# EAGLE design Power (EAGLE 7.1.0)
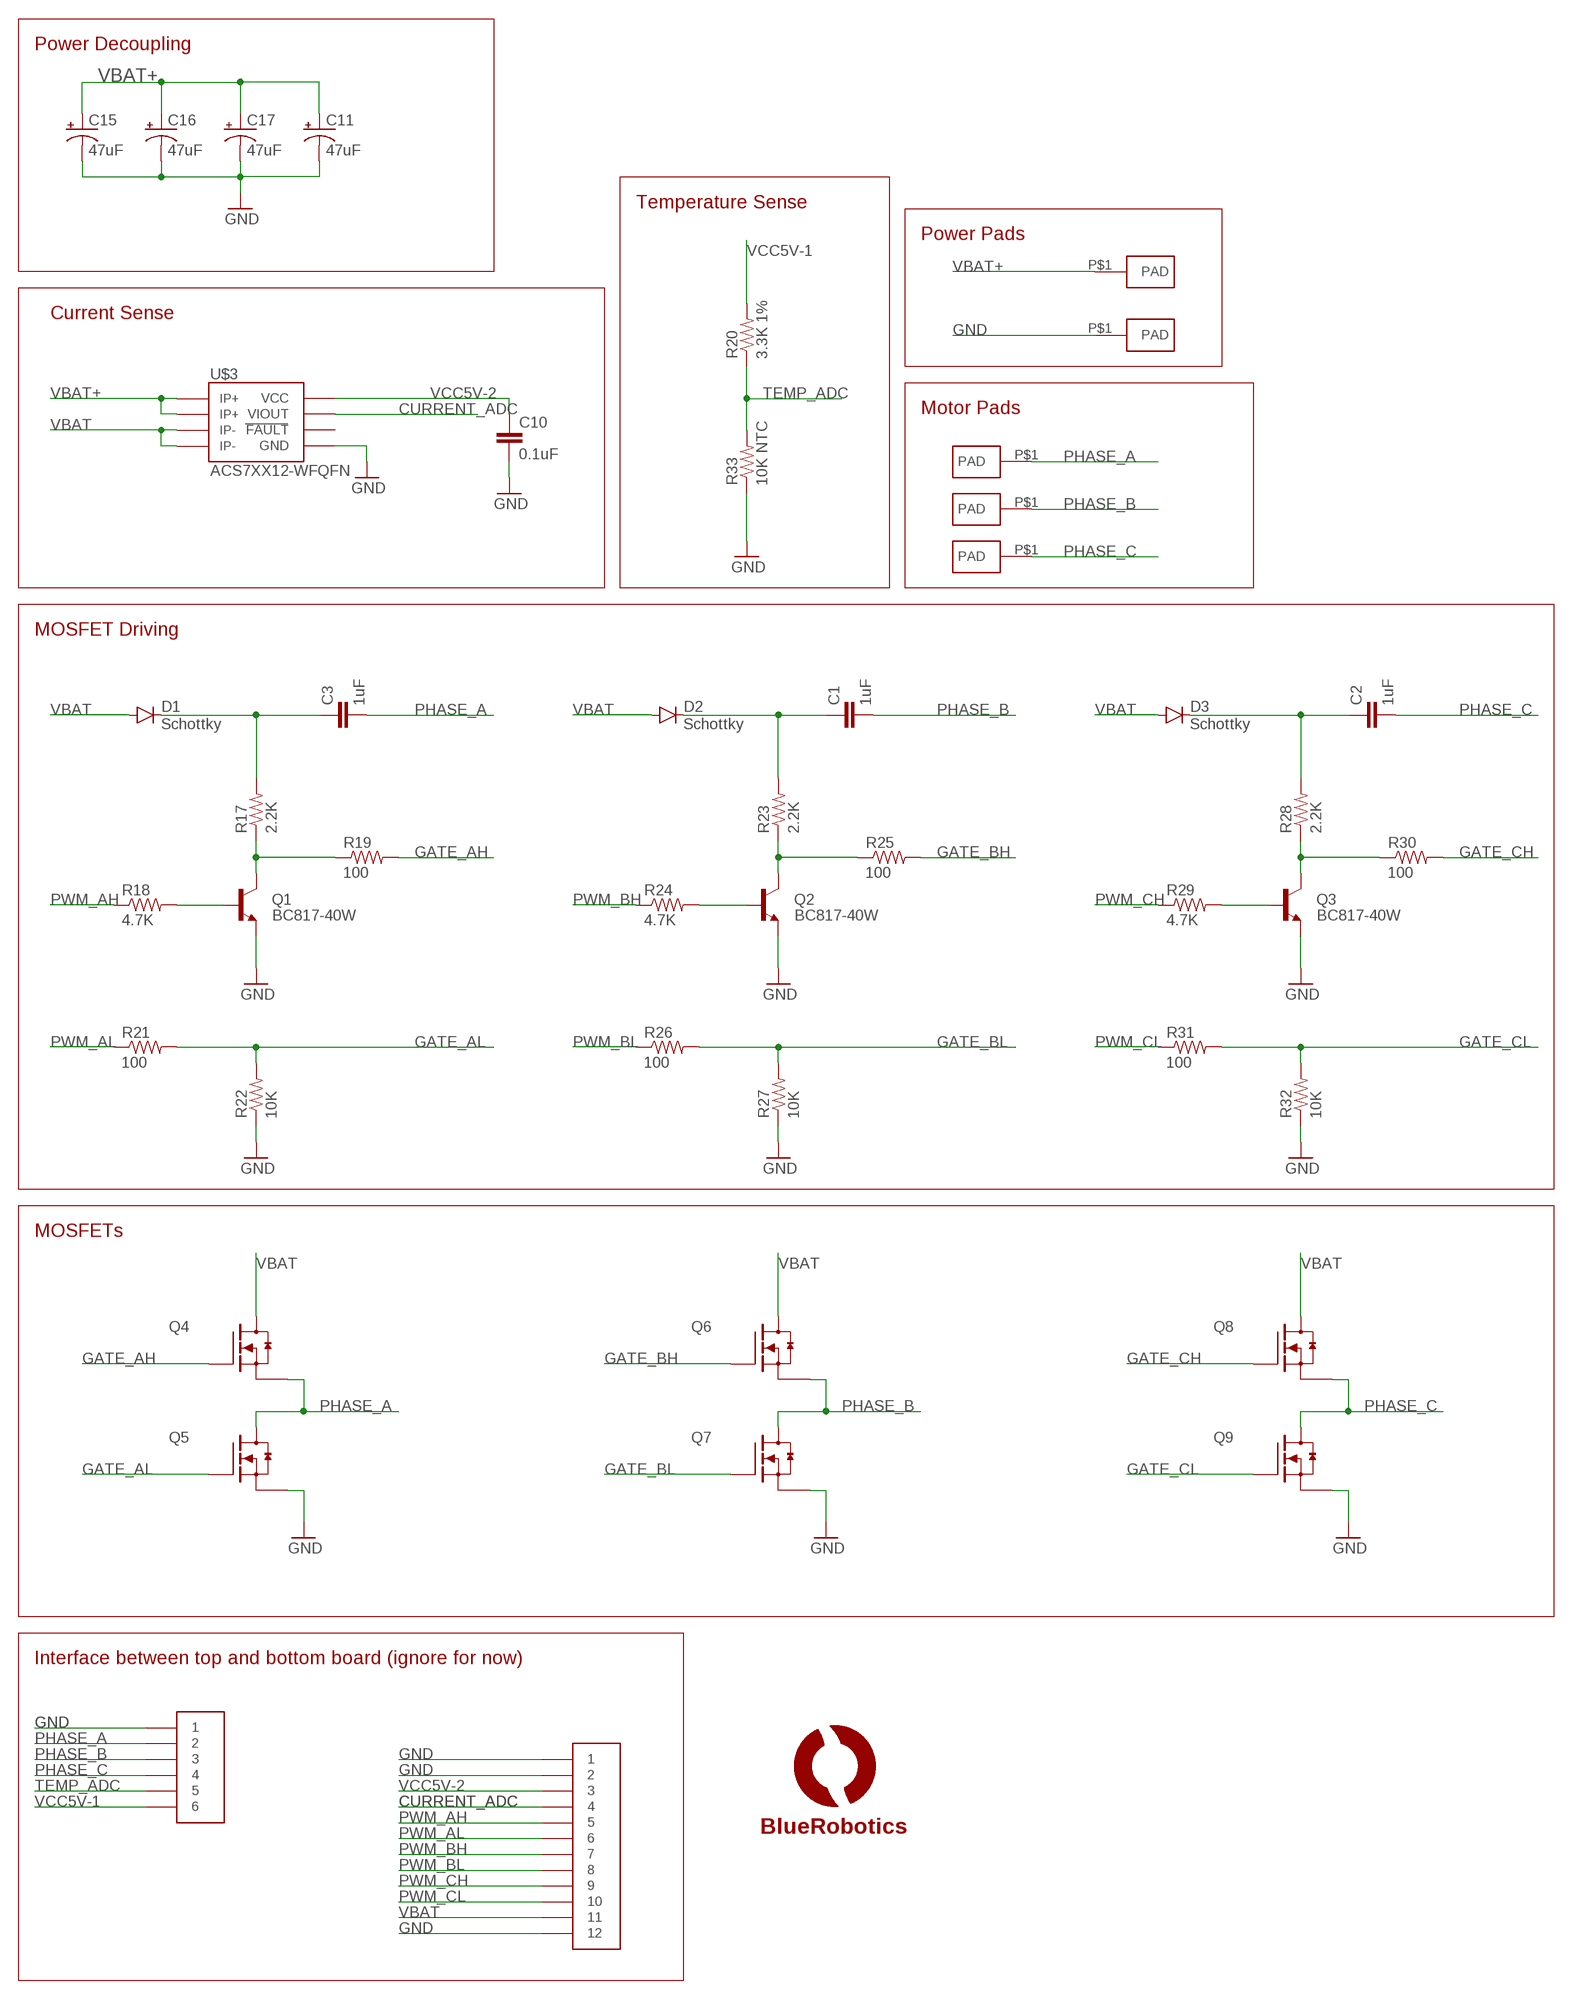
[diagram p0: schematic, sheet 1]

## Parts
C1  1uF  CAP0805  [0805]
C2  1uF  CAP0805  [0805]
C3  1uF  CAP0805  [0805]
C10  0.1uF  CAP0603-CAP  [0603-CAP]
C11  47uF  CAP_POL7343  [EIA7343]
C15  47uF  CAP_POL7343  [EIA7343]
C16  47uF  CAP_POL7343  [EIA7343]
C17  47uF  CAP_POL7343  [EIA7343]
D1  Schottky  DIODESOD  [SOD-323]
D2  Schottky  DIODESOD  [SOD-323]
D3  Schottky  DIODESOD  [SOD-323]
Q1  BC817-40W  TRANSISTOR_NPNSOT23  [SOT23]
Q2  BC817-40W  TRANSISTOR_NPNSOT23  [SOT23]
Q3  BC817-40W  TRANSISTOR_NPNSOT23  [SOT23]
Q4  SI7370  [POWERPAK-SO-08]
Q5  SI7370  [POWERPAK-SO-08]
Q6  SI7370  [POWERPAK-SO-08]
Q7  SI7370  [POWERPAK-SO-08]
Q8  SI7370  [POWERPAK-SO-08]
Q9  SI7370  [POWERPAK-SO-08]
R17  2.2K  33KOHM1/10W1%(0603)  [0603-RES]
R18  4.7K  33KOHM1/10W1%(0603)  [0603-RES]
R19  100  33KOHM1/10W1%(0603)  [0603-RES]
R20  3.3K 1%  33KOHM1/10W1%(0603)  [0603-RES]
R21  100  33KOHM1/10W1%(0603)  [0603-RES]
R22  10K  33KOHM1/10W1%(0603)  [0603-RES]
R23  2.2K  33KOHM1/10W1%(0603)  [0603-RES]
R24  4.7K  33KOHM1/10W1%(0603)  [0603-RES]
R25  100  33KOHM1/10W1%(0603)  [0603-RES]
R26  100  33KOHM1/10W1%(0603)  [0603-RES]
R27  10K  33KOHM1/10W1%(0603)  [0603-RES]
R28  2.2K  33KOHM1/10W1%(0603)  [0603-RES]
R29  4.7K  33KOHM1/10W1%(0603)  [0603-RES]
R30  100  33KOHM1/10W1%(0603)  [0603-RES]
R31  100  33KOHM1/10W1%(0603)  [0603-RES]
R32  10K  33KOHM1/10W1%(0603)  [0603-RES]
R33  10K NTC  33KOHM1/10W1%(0603)  [0603-RES]
U$1  PADPTH-MED  [PAD-PTH-MED-1]
U$2  PADPTH-MED  [PAD-PTH-MED-1]
U$3  ACS7XX12-WFQFN  [12-WFQFN]
U$4  HEADER-62MM  [HEADER-2MM-6POS]
U$5  PAD2X3MM  [PAD-2X3MM]
U$6  PAD2X3MM  [PAD-2X3MM]
U$7  PAD2X3MM  [PAD-2X3MM]
U$8  HEADER-122MM  [HEADER-2MM-12POS]
U$9  LOGOBR-LOGO-S  [BR-LOGO-SMALL]

## Nets
CURRENT_ADC: U$3.VIOUT U$8.P$4
GATE_AH: Q4.4(G) R19.2
GATE_AL: Q5.4(G) R21.2 R22.2
GATE_BH: Q6.4(G) R25.2
GATE_BL: Q7.4(G) R26.2 R27.2
GATE_CH: Q8.4(G) R30.2
GATE_CL: Q9.4(G) R31.2 R32.2
GND: C10.2 C11.C(-) C15.C(-) C16.C(-) C17.C(-) Q1.2(E) Q2.2(E) Q3.2(E) Q5.3(S3) Q7.3(S3) Q9.3(S3) R22.1 R27.1 R32.1 R33.1 U$2.P$1(PAD) U$3.GND U$4.P$1 U$8.P$1 U$8.P$2 U$8.P$12
N$2: Q1.1(B) R18.2
N$4: Q1.3(C) R17.1 R19.1
N$5: Q2.1(B) R24.2
N$6: Q2.3(C) R23.1 R25.1
N$7: Q3.1(B) R29.2
N$9: Q3.3(C) R28.1 R30.1
N$12: C3.1 D1.C R17.2
N$15: C1.1 D2.C R23.2
N$19: C2.1 D3.C R28.2
PHASE_A: C3.2 Q4.3(S3) Q5.5-8(D) U$4.P$2 U$5.P$1(PAD)
PHASE_B: C1.2 Q6.3(S3) Q7.5-8(D) U$4.P$3 U$6.P$1(PAD)
PHASE_C: C2.2 Q8.3(S3) Q9.5-8(D) U$4.P$4 U$7.P$1(PAD)
PWM_AH: R18.1 U$8.P$5
PWM_AL: R21.1 U$8.P$6
PWM_BH: R24.1 U$8.P$7
PWM_BL: R26.1 U$8.P$8
PWM_CH: R29.1 U$8.P$9
PWM_CL: R31.1 U$8.P$10
TEMP_ADC: R20.1 R33.2 U$4.P$5
VBAT: D1.A D2.A D3.A Q4.5-8(D) Q6.5-8(D) Q8.5-8(D) U$3.IP-1 U$3.IP-2 U$8.P$11
VBAT+: C11.A(+) C15.A(+) C16.A(+) C17.A(+) U$1.P$1(PAD) U$3.IP+1 U$3.IP+2
VCC5V-1: R20.2 U$4.P$6
VCC5V-2: C10.1 U$3.VCC U$8.P$3
Unconnected: Q4.1(S1) Q4.2(S2) Q5.1(S1) Q5.2(S2) Q6.1(S1) Q6.2(S2) Q7.1(S1) Q7.2(S2) Q8.1(S1) Q8.2(S2) Q9.1(S1) Q9.2(S2) U$3.FAULT

## Notes on the sheet
- Power Decoupling
- Temperature Sense
- Power Pads
- Current Sense
- Motor Pads
- MOSFET Driving
- MOSFETs
- Interface between top and bottom board (ignore for now)

## Library data of the parts
C1-C3 C10 = SparkFun-Capacitors:CAP: Capacitor Standard 0603 ceramic capacitor, and 0.1" leaded capacitor.
C11 C15-C17 = SparkFun-Capacitors:CAP_POL: Capacitor Polarized These are standard SMD and PTH capacitors. Normally 10uF, 47uF, and 100uF in electrolytic and tantalum varieties. Always verify the external diameter of the through hole cap, it varies with capacity, voltage, and manufacturer. The EIA devices should be standard.
D1-D3 = SparkFun-DiscreteSemi:DIODE: Diode These are standard reverse protection diodes and small signal diodes. SMA package can handle up to about 1A. SOD-323 can handle about 200mA. What the SOD-323 package when ordering, there are some mfgs out there that are 5-pin packages.; PROD_ID: DIO-09646
Q1-Q3 = SparkFun-DiscreteSemi:TRANSISTOR_NPN: Generic NPN BJT MMBT2222A - TRANS-08049 (SOT-23, 1A 40V) MPSA42 - TRANS-09116 (SOT-23, 500mA 300V) MMBT5088LT1G - TRANS-11160 (SOT-23, 50 mA 30V) BC547 - COM-08928 <http://www.sparkfun.com/products/8928> (TO-92 45V 100mA) (1.Collector 2.Base 3.Emitter) 2N3904 - COM-00521 <http://www.sparkfun.com/products/521> (TO-92 40V 200mA) (1.Emitter 2.Base 3.Collector) P2N2222A - COM-12852 <http://www.sparkfun.com/products/12852> (TO-92 40V 600mA) (1.Collector 2.Base 3.Emitter)
Q4-Q9 = transistor-fet-bobstarr:SI7370: N-Channel MOSFET - 60v
R17-R33 = SparkFun-Resistors:33KOHM1/10W1%(0603): RES-08416
U$1 U$2 U$5-U$7 = BR-Eagle-Library:PAD
U$3 = BR-Eagle-Library:ACS7XX
U$4 = BR-Eagle-Library:HEADER-6
U$8 = BR-Eagle-Library:HEADER-12
U$9 = BR-Eagle-Library:LOGO

## Board
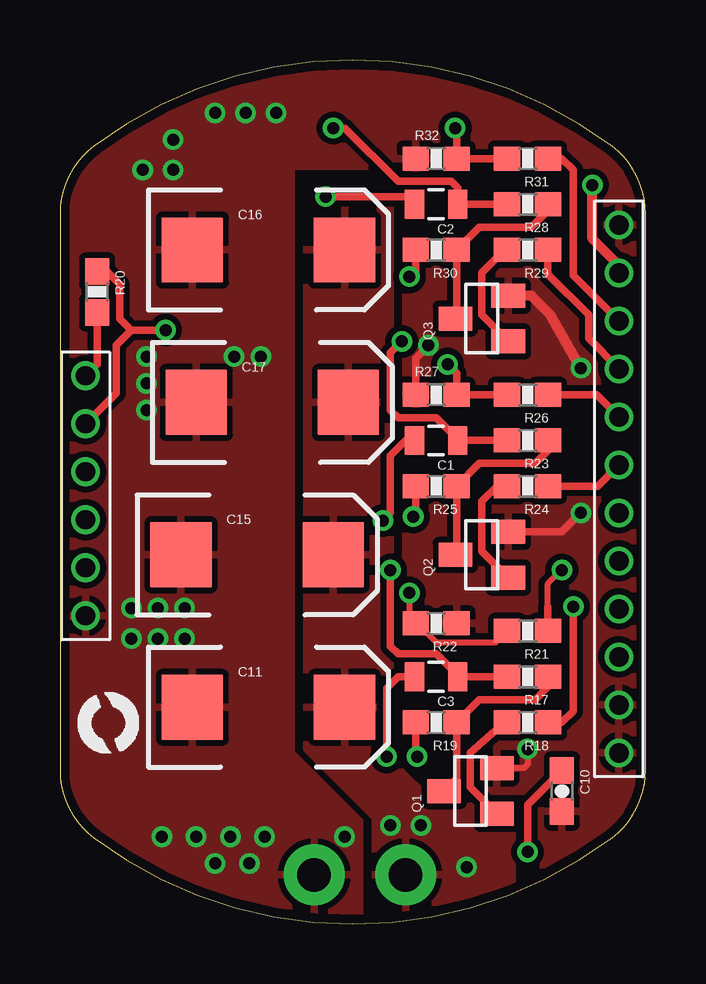
[diagram p1: board, top side]
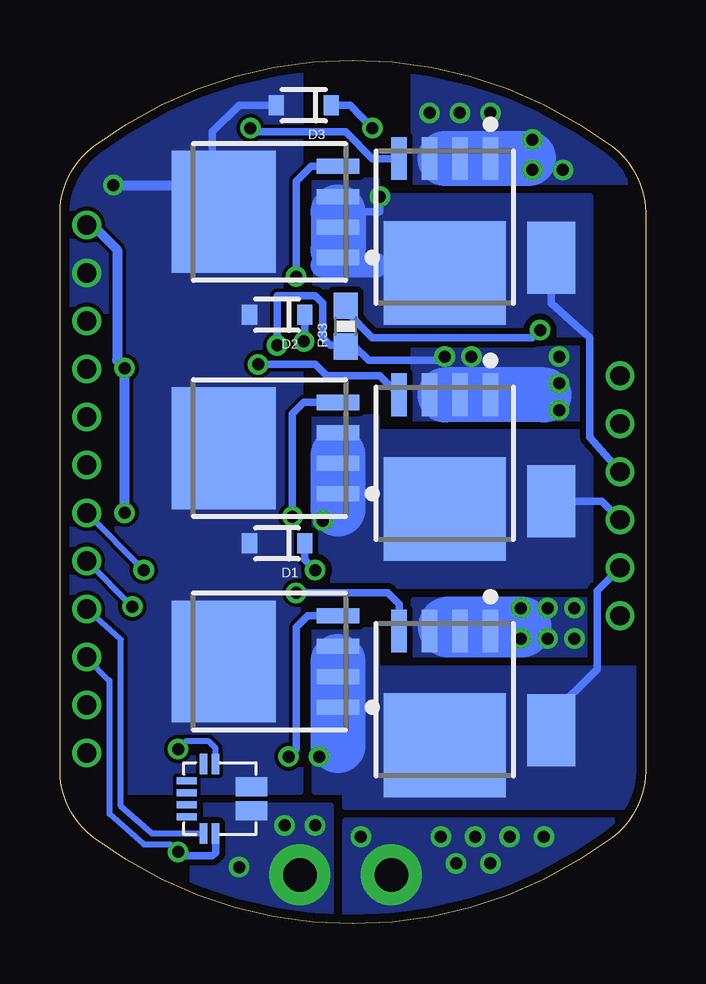
[diagram p2: board, bottom side, seen from below]

Size 24.4 x 36 mm. Coordinates in mm from the lower left corner, seen from the top.
Outline: 23,32.4 arc74 1.4,32.4 arc53 0,29.6 0,6.4 arc53 1.4,3.6 arc74 23,3.6 arc53 24.4,6.4 24.4,29.6 arc53 23,32.4
Copper layers (1*16): Top 0.0356mm / dielectric 1.5011mm / Bottom 0.0356mm
Design rules "OSH-Park": minimum track width 6mil, minimum drill 13mil, track to track 6mil, track to pad 6mil, pad to pad 6mil, via to via 6mil, smd to smd 6mil, copper to edge 15mil, drill to drill 6mil, minimum pad ring 7mil, minimum via ring 7mil, stop-mask expansion 3mil, vias tented up to drill 0mil, thermal gap 10mil

### Footprints (pad centres in the part's own frame; a part is rotated, then mirrored left to right if it is on the bottom)
0805 = smd 0.8 x 1.2: 1 -0.9,0; 2 0.9,0
0603-CAP = smd 1.1 x 1: 1 -0.85,0; 2 0.85,0
EIA7343 = smd 2.55 x 2.7: A 3.17,0; C -3.17,0
SOD-323 = smd 0.63 x 0.83: A 1.15,0; C -1.15,0
SOT23 = smd 1 x 1.4: 1 -0.95,-1.1; 2 0.95,-1.1; 3 0,1.1
POWERPAK-SO-08 = smd 0.635 x 1.778: 1 -1.905,-2.857; 2 -0.635,-2.857; 3 0.635,-2.857; 4 1.905,-2.857 | smd 5.08 x 4.318: 5-8 0,1.905
0603-RES = smd 1.1 x 1: 1 -0.85,0; 2 0.85,0
PAD-PTH-MED-1 = drill 1.4 pad 2.54: P$1 0,0
12-WFQFN = smd 0.3 x 0.85: FAULT 0.683,-1.445; GND 0.185,-1.446; VCC 0.183,1.456; VIOUT 0.683,1.456 | smd 1.3 x 0.4: IP+1 -1.317,0.705; IP+2 -1.315,0.301; IP-1 -1.317,-0.295; IP-2 -1.317,-0.699 | smd 0.85 x 0.3: NC1 1.383,0.754; NC2 1.383,0.256; NC3 1.384,-0.245; NC4 1.385,-0.745
HEADER-2MM-6POS = drill 0.8: P$1 0,0; P$2 2,0; P$3 4,0; P$4 6,0; P$5 8,0; P$6 10,0
PAD-2X3MM = smd 3 x 2: P$1 0,0
HEADER-2MM-12POS = drill 0.8: P$1 0,0; P$2 2,0; P$3 4,0; P$4 6,0; P$5 8,0; P$6 10,0; P$7 12,0; P$8 14,0; P$9 16,0; P$10 18,0; P$11 20,0; P$12 22,0

### Placement (x,y rotation side)
C1  15.67,20.15 180 top
C2  15.67,29.99 180 top
C3  15.67,10.3 180 top
C10  20.91,5.54 270 top
C11  8.69,9.03 0 top
C15  8.21,15.38 0 top
C16  8.69,28.08 0 top
C17  8.85,21.73 0 top
D1  15.35,15.86 180 bottom
D2  15.35,25.38 180 bottom
D3  14.24,34.12 180 bottom
Q1  17.1,5.54 90 top
Q2  17.58,15.38 90 top
Q3  17.58,25.23 90 top
Q4  15.67,10.94 90 bottom
Q5  8.37,9.35 180 bottom
Q6  15.67,19.83 90 bottom
Q7  8.37,19.19 180 bottom
Q8  15.67,29.67 90 bottom
Q9  8.37,29.04 180 bottom
R17  19.48,10.3 180 top
R18  19.48,8.4 180 top
R19  15.67,8.4 180 top
R20  1.54,26.34 270 top
R21  19.48,12.21 180 top
R22  15.67,12.53 180 top
R23  19.48,20.15 180 top
R24  19.48,18.24 180 top
R25  15.67,18.24 180 top
R26  19.48,22.05 180 top
R27  15.67,22.05 0 top
R28  19.48,29.99 180 top
R29  19.48,28.08 180 top
R30  15.67,28.08 180 top
R31  19.48,31.89 180 top
R32  15.67,31.89 0 top
R33  12.5,24.91 90 bottom
U$1  14.4,2.05 0 top
U$2  10.59,2.05 0 top
U$3  17.73,5.22 180 bottom
U$4  1.07,12.84 90 top
U$5  3.92,8.08 270 bottom
U$6  3.92,17.61 90 bottom
U$7  3.92,27.77 270 bottom
U$8  23.29,7.13 90 top
U$9  0.75,7.13 0 top

### Tracks (layer width: path | path; a pad name or v marks a point on that pad's centre or on a via)
CURRENT_ADC
  Bottom 0.254: U$3.VIOUT 20.57,3.77 21.86,4.91 21.86,11.86 U$8.P$4
GATE_AH  (via drill 0.5)
  Top 0.305: R19.2 14.82,7.03 v14.88,6.97
  Bottom 0.305: v14.88,6.97 14.56,7.29 14.56,12.37 14.08,12.84 Q4.4
GATE_AL  (via drill 0.5)
  Top 0.254: v14.56,13.8 14.56,12.79 R22.2 14.88,12.53 15.67,11.73 18.16,11.73 R21.2
  Top 0.305: R21.2 18.63,12.47
  Bottom 0.305: v14.56,13.8 10.75,13.8 10.27,13.32 Q5.4
GATE_BH  (via drill 0.5)
  Top 0.305: R25.2 14.82,17.07 v14.72,16.97
  Bottom 0.305: v14.72,16.97 14.72,21.26 14.24,21.73 Q6.4
GATE_BL  (via drill 0.5)
  Top 0.305: v16.15,23.32 16.52,22.95 R27.2 R26.2
  Bottom 0.305: v16.15,23.32 13.77,23.32 13.29,22.84 11.07,22.84 Q7.4
GATE_CH  (via drill 0.5)
  Top 0.305: R30.2 14.82,27.23 v14.56,26.97
  Bottom 0.305: v14.56,26.97 14.56,30.94 13.93,31.58 Q8.4
GATE_CL  (via drill 0.5)
  Top 0.305: R31.2 R32.2 16.52,33.11 v16.47,33.16
  Bottom 0.305: Q9.4 11.39,31.89 12.5,33 16.31,33 v16.47,33.16
GND  (via drill 0.5)
  Top 0.254: v19.48,7.29 19.48,6.65 19.32,6.49 Q1.2
  Top 0.305: Q2.2 20.91,16.33 v21.7,17.13 | R27.1 14.82,23.58 v15.35,24.11
  Top 0.406: v21.7,23.16 20.43,25.38 19.64,26.18 Q3.2
  Bottom 0.254: U$3.GND 17.92,7.31 18.21,7.6 19.16,7.6 v19.48,7.29
  Bottom 0.305: v8.37,23.64 8.53,23.48 11.54,23.48 12.12,24.06 R33.1 12.55,24.11 13.13,24.11 13.45,24.43 13.45,25.86 13.77,26.18 15.35,26.18 v15.35,24.11
  Bottom 0.406: U$8.P$12 23.07,29.13 22.02,28.08 22.02,23.48 v21.7,23.16 v21.7,17.13
  Bottom 0.61: Q5.3 8.21,12.21 8.21,12.37
  Bottom 2.286: 4.24,22.05 8.37,22.05 | 4.88,31.89 8.37,31.89
  Bottom 2.54: 5.19,12.37 8.21,12.37
  other vias: 8.53,3.64 7.1,3.64 5.67,3.64 4.24,3.64 7.89,2.52 6.46,2.52 11.86,3.64 2.97,13.16 2.97,11.89 4.08,13.16 5.19,13.16 4.08,11.89 5.19,11.89 3.61,21.42 3.61,22.53 3.61,23.64 7.26,23.64 3.45,31.42 4.72,31.42 9,33.8 7.73,33.8 4.72,32.69 6.46,33.8
  pour Bottom (isolate 0.254, no thermals): -1.47,30.94 -1.47,35.7 9.64,35.7 9.64,30.94
  pour Bottom (isolate 0.254, no thermals): 2.34,21.1 2.34,23.96 9.64,23.96 9.64,21.1
  pour Bottom (isolate 0.254, no thermals): 2.34,11.26 2.34,13.48 9.64,13.48 9.64,11.26
  pour Bottom (isolate 0.254, no thermals): 12.5,-2.4 12.5,4.27 -1.47,4.27 -1.47,-2.4
  pour Top (isolate 0.254): 12.5,-1.13 -2.74,-1.13 -2.74,36.97 9.64,36.97 9.64,7.13 12.5,4.27
  pour Top (isolate 0.254): 19.48,-1.13 25.2,-1.13 25.2,36.97 7.26,36.97 7.26,31.58 14.4,31.58 14.4,7.13 15.99,5.54 19.48,5.54
N$2
  Top 0.305: R18.2 18.53,8.4 17.1,7.13 17.1,5.69 Q1.1
N$4
  Top 0.305: R17.1 20.33,9.88 19.8,9.35 17.47,9.35 R19.1 16.52,6.06 Q1.3
N$5
  Top 0.305: R24.2 18.21,18.24 17.58,17.61 17.58,15.53 Q2.1
N$6
  Top 0.305: R23.1 20.33,19.73 19.8,19.19 17.47,19.19 R25.1 16.52,15.43 Q2.3
N$7
  Top 0.305: R29.2 18.53,28.08 17.58,27.13 17.58,25.38 Q3.1
N$9
  Top 0.305: R28.1 20.33,29.73 19.64,29.04 17.47,29.04 R30.1 16.52,25.27 Q3.3
N$12  (via drill 0.5)
  Top 0.305: R17.2 C3.1 16.57,10.36 15.67,11.26 14.08,11.26 13.77,11.57 v13.77,14.75
  Bottom 0.305: D1.C 14.2,15.19 v13.77,14.75
N$15  (via drill 0.5)
  Top 0.305: R23.2 C1.1 16.57,20.2 15.67,21.1 14.08,21.1 13.77,21.42 13.77,23.8 v14.24,24.27
  Bottom 0.305: D2.C 14.2,24.31 v14.24,24.27
N$19  (via drill 0.5)
  Top 0.305: R28.2 C2.1 16.57,30.68 16.31,30.94 14.08,30.94 11.86,33.16 v11.39,33.16
  Bottom 0.305: 13.13,34.08 D3.C 12.3,34.12 v11.39,33.16
PHASE_A  (via drill 0.5)
  Top 0.305: C3.2 14.08,10.3 13.61,9.83 v13.61,6.97
  Bottom 0.305: v13.61,6.97 13.61,7.45 12.81,8.24 | U$5.P$1 3.92,8.72 2.02,10.62 2.02,13.89 U$4.P$2
  Bottom 2.286: 12.81,7.45 12.81,8.24 12.81,10.94
  pour Bottom (isolate 0.254, no thermals): 13.77,5.54 12.5,5.54 12.5,4.91 -1.47,4.91 -1.47,10.62 11.23,10.62 11.23,12.21 13.77,12.21
PHASE_B  (via drill 0.5)
  Top 0.305: C1.2 14.4,20.15 13.77,19.51 13.77,17.13 v13.45,16.81
  Bottom 0.305: v13.45,16.81 12.81,17.29 | U$6.P$1 1.83,17.61 U$4.P$3
  Bottom 2.286: 12.81,17.29 12.81,19.51
  pour Bottom (isolate 0.254, no thermals): 2.34,14.11 2.34,20.46 11.23,20.46 11.23,21.1 13.77,21.1 13.77,14.11
PHASE_C  (via drill 0.5)
  Top 0.305: C2.2 14.72,29.99 14.4,30.31 v11.07,30.31
  Bottom 0.305: v11.07,30.31 11.07,29.67 12.81,29.67 | U$7.P$1 3.92,25.86 2.34,24.43 2.34,20.27 U$4.P$4
  Bottom 1.016: 11.23,27.45 13.45,27.45
  Bottom 2.286: 12.81,29.67 12.81,28.08
  pour Bottom (isolate 0.254, no thermals): 2.34,24.59 2.34,30.31 11.23,30.31 11.23,30.94 13.77,30.94 13.77,24.59
PWM_AH  (via drill 0.5)
  Top 0.305: R18.1 20.91,8.4 21.39,8.87 v21.39,13.22
  Bottom 0.254: v21.39,13.22 U$8.P$5
PWM_AL  (via drill 0.5)
  Top 0.254: 20.33,13.22 20.33,14.17 v20.91,14.75
  Top 0.305: R21.1 20.33,13.22
  Bottom 0.254: v20.91,14.75 U$8.P$6
PWM_BH
  Top 0.305: R24.1 22.4,18.24 U$8.P$7
PWM_BL
  Top 0.305: R26.1 22.37,22.05 U$8.P$8
PWM_CH
  Top 0.305: R29.1 20.33,27.07 22.02,25.38 22.02,24.4 U$8.P$9
PWM_CL
  Top 0.305: R31.1 20.91,31.89 21.39,31.42 21.39,27.03 U$8.P$10
TEMP_ADC  (via drill 0.5)
  Top 0.305: v4.4,24.75 2.97,24.75 | 2.97,24.75 2.34,24.11 2.34,22.11 U$4.P$5 | R20.1 1.96,27.19 2.5,26.65 2.5,25.23 2.97,24.75
  Bottom 0.305: R33.2 12.5,25.54 11.39,24.43 4.72,24.43 v4.4,24.75
VBAT  (via drill 0.5)
  Top 0.406: U$8.P$11 23.29,27.45 22.18,28.56 v22.18,30.78
  Bottom 0.305: D3.A 16.94,34.12 18.05,33 18.05,31.42 18.69,30.78
  Bottom 0.406: v22.18,30.78 18.69,30.78 Q8.5-8
  pour Bottom (no thermals): 14.4,5.54 14.4,36.34 26.47,36.34 26.47,5.54
VBAT+  (via drill 0.5)
  other vias: 13.77,4.11 15.04,4.11 16.94,2.37
  pour Bottom (isolate 0.254, no thermals): 13.13,-0.65 13.13,4.91 18.85,4.91 18.85,-2.4 16.31,-1.13
  pour Top (isolate 0.254): 13.13,-1.13 13.13,4.43 10.27,7.29 10.27,30.94 13.77,30.94 13.77,6.81 15.67,4.91 18.85,4.91 18.85,-1.13
VCC5V-1
  Top 0.254: 1.54,23.32 U$4.P$6
  Top 0.305: R20.2 1.54,23.32
VCC5V-2  (via drill 0.5)
  Top 0.305: v19.48,3 19.48,4.96 C10.1
  Bottom 0.254: U$8.P$3 23.29,11.1 22.34,10.14 22.34,4.59 20.91,3.32 19.8,3.32 v19.48,3
  Bottom 0.305: U$3.VCC 17.92,2.98 18.05,2.84 19.32,2.84 v19.48,3

### Text on the board
tDocu: GND | V+ | 5V | T | C | B | A | GND | 5V | BLUESC-ELEC-POWER-X1A | GND | + | -
bDocu: C | B | A